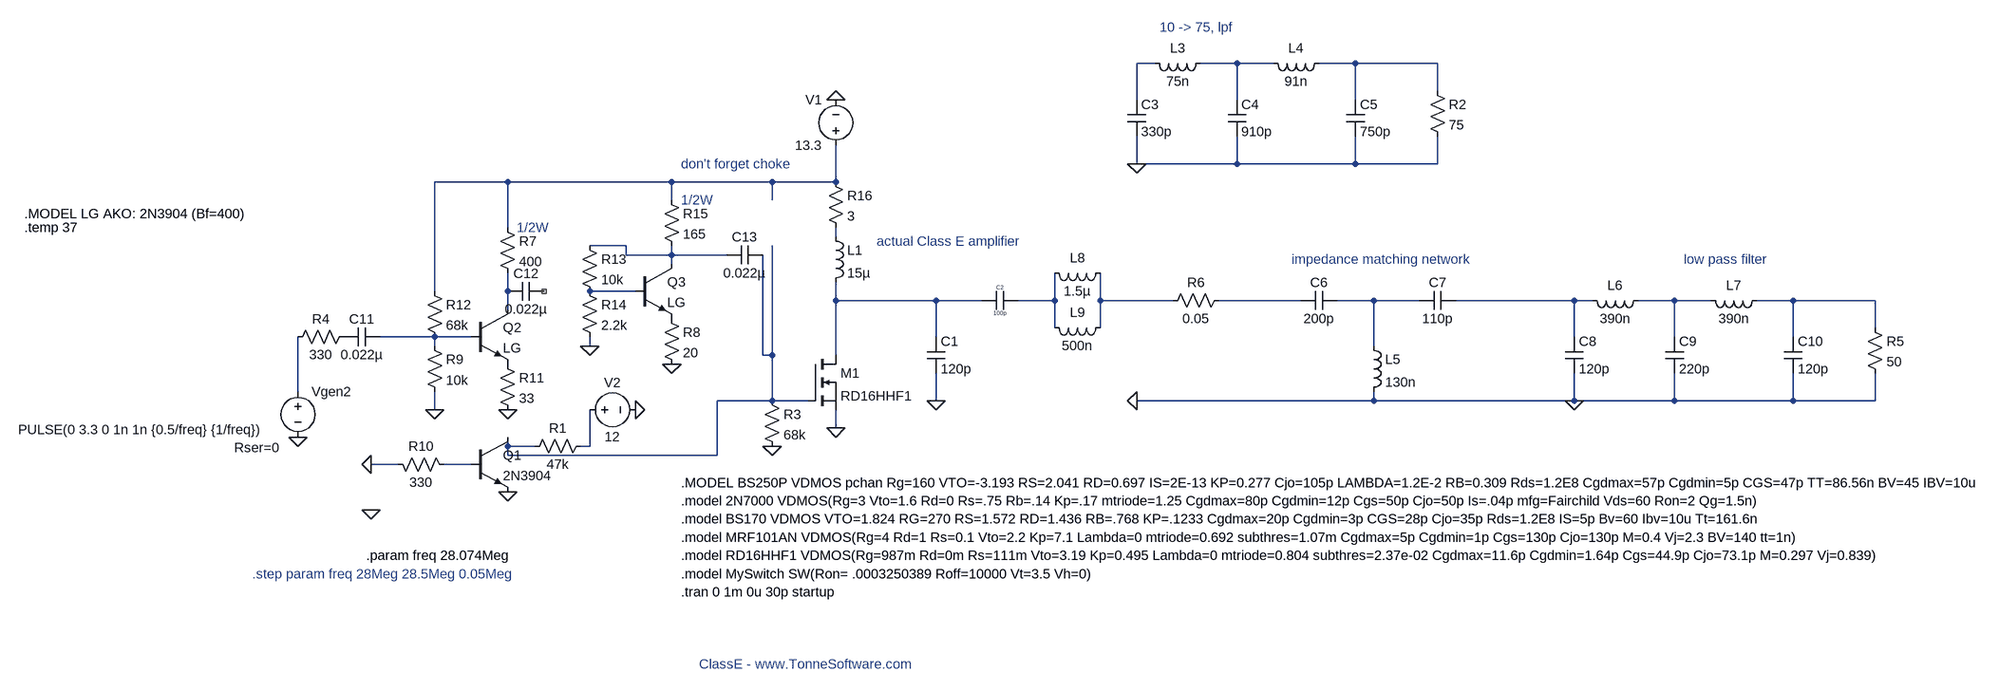
[diagram p0: schematic 28mhz_class_e_latest.asc]
28mhz_class_e_latest.asc, the LTspice schematic file:
Version 4
SHEET 1 2496 912
WIRE 832 -528 800 -528
WIRE 976 -528 912 -528
WIRE 1040 -528 976 -528
WIRE 1184 -528 1120 -528
WIRE 1328 -528 1184 -528
WIRE 1328 -480 1328 -528
WIRE 800 -464 800 -528
WIRE 976 -464 976 -528
WIRE 1184 -464 1184 -528
WIRE 800 -352 800 -400
WIRE 976 -352 976 -400
WIRE 976 -352 800 -352
WIRE 1184 -352 1184 -400
WIRE 1184 -352 976 -352
WIRE 1328 -352 1328 -400
WIRE 1328 -352 1184 -352
WIRE -304 -320 -432 -320
WIRE -16 -320 -304 -320
WIRE 160 -320 -16 -320
WIRE 272 -320 272 -384
WIRE 272 -320 160 -320
WIRE -16 -288 -16 -320
WIRE 160 -288 160 -320
WIRE -304 -240 -304 -320
WIRE 272 -224 272 -240
WIRE -96 -208 -160 -208
WIRE -96 -192 -96 -208
WIRE -16 -192 -16 -208
WIRE -16 -192 -96 -192
WIRE 80 -192 -16 -192
WIRE -16 -176 -16 -192
WIRE -432 -128 -432 -320
WIRE -304 -128 -304 -160
WIRE -80 -128 -160 -128
WIRE 272 -112 272 -144
WIRE 448 -112 272 -112
WIRE 528 -112 448 -112
WIRE 656 -112 656 -160
WIRE 656 -112 592 -112
WIRE 736 -112 736 -160
WIRE 864 -112 736 -112
WIRE 1088 -112 944 -112
WIRE 1216 -112 1152 -112
WIRE 1296 -112 1216 -112
WIRE 1568 -112 1360 -112
WIRE 1600 -112 1568 -112
WIRE 1744 -112 1680 -112
WIRE 1808 -112 1744 -112
WIRE 1952 -112 1888 -112
WIRE 2096 -112 1952 -112
WIRE -304 -96 -304 -128
WIRE 656 -64 656 -112
WIRE 736 -64 736 -112
WIRE 2096 -64 2096 -112
WIRE -432 -48 -528 -48
WIRE -368 -48 -432 -48
WIRE 448 -48 448 -112
WIRE 1568 -48 1568 -112
WIRE 1744 -48 1744 -112
WIRE 1952 -48 1952 -112
WIRE -432 -32 -432 -48
WIRE -160 -32 -160 -48
WIRE 1216 -32 1216 -112
WIRE 144 -16 144 -192
WIRE 160 -16 160 -208
WIRE 160 -16 144 -16
WIRE 272 -16 272 -112
WIRE -672 48 -672 -48
WIRE 160 64 160 -16
WIRE 160 64 64 64
WIRE 224 64 160 64
WIRE 448 64 448 16
WIRE 1216 64 1216 48
WIRE 1216 64 800 64
WIRE 1568 64 1568 16
WIRE 1568 64 1216 64
WIRE 1744 64 1744 16
WIRE 1744 64 1568 64
WIRE 1952 64 1952 16
WIRE 1952 64 1744 64
WIRE 2096 64 2096 16
WIRE 2096 64 1952 64
WIRE -432 80 -432 48
WIRE 272 112 272 80
WIRE -304 144 -304 128
WIRE -256 144 -304 144
WIRE -160 144 -160 80
WIRE -160 144 -176 144
WIRE -304 160 -304 144
WIRE 64 160 64 64
WIRE 64 160 -304 160
WIRE -496 176 -544 176
WIRE -368 176 -416 176
FLAG 272 112 0
FLAG 448 64 0
FLAG 800 64 0
FLAG -672 128 0
FLAG 800 -352 0
FLAG 1568 64 0
FLAG 272 -464 0
FLAG -304 80 0
FLAG -432 80 0
FLAG -160 -32 0
FLAG -16 0 0
FLAG 160 144 0
FLAG -80 80 0
FLAG -304 224 0
FLAG -544 256 0
FLAG -544 176 0
SYMBOL ind 256 -240 R0
SYMATTR InstName L1
SYMATTR Value 15µ
SYMBOL cap 432 -48 R0
SYMATTR InstName C1
SYMATTR Value 120p
SYMBOL cap 592 -128 R90
WINDOW 0 0 32 VBottom 0
WINDOW 3 32 32 VTop 0
SYMATTR InstName C2
SYMATTR Value 100p
SYMBOL nmos 224 -16 R0
SYMATTR InstName M1
SYMATTR Value RD16HHF1
SYMBOL voltage -672 32 R0
WINDOW 123 24 132 Left 0
WINDOW 39 -112 115 Left 2
WINDOW 3 -491 83 Left 2
SYMATTR SpiceLine Rser=0
SYMATTR Value PULSE(0 3.3 0 1n 1n {0.5/freq} {1/freq})
SYMATTR InstName Vgen2
SYMBOL ind 928 -544 R90
WINDOW 0 5 56 VBottom 2
WINDOW 3 32 56 VTop 2
SYMATTR InstName L3
SYMATTR Value 75n
SYMBOL ind 1136 -544 R90
WINDOW 0 5 56 VBottom 2
WINDOW 3 32 56 VTop 2
SYMATTR InstName L4
SYMATTR Value 91n
SYMBOL cap 784 -464 R0
SYMATTR InstName C3
SYMATTR Value 330p
SYMBOL cap 960 -464 R0
SYMATTR InstName C4
SYMATTR Value 910p
SYMBOL cap 1168 -464 R0
SYMATTR InstName C5
SYMATTR Value 750p
SYMBOL res 1312 -496 R0
SYMATTR InstName R2
SYMATTR Value 75
SYMBOL cap 1152 -128 R90
WINDOW 0 0 32 VBottom 2
WINDOW 3 32 32 VTop 2
SYMATTR InstName C6
SYMATTR Value 200p
SYMBOL ind 1200 -48 R0
SYMATTR InstName L5
SYMATTR Value 130n
SYMBOL cap 1360 -128 R90
WINDOW 0 0 32 VBottom 2
WINDOW 3 32 32 VTop 2
SYMATTR InstName C7
SYMATTR Value 110p
SYMBOL ind 1696 -128 R90
WINDOW 0 5 56 VBottom 2
WINDOW 3 32 56 VTop 2
SYMATTR InstName L6
SYMATTR Value 390n
SYMBOL ind 1904 -128 R90
WINDOW 0 5 56 VBottom 2
WINDOW 3 32 56 VTop 2
SYMATTR InstName L7
SYMATTR Value 390n
SYMBOL cap 1552 -48 R0
SYMATTR InstName C8
SYMATTR Value 120p
SYMBOL cap 1728 -48 R0
SYMATTR InstName C9
SYMATTR Value 220p
SYMBOL cap 1936 -48 R0
SYMATTR InstName C10
SYMATTR Value 120p
SYMBOL res 2080 -80 R0
SYMATTR InstName R5
SYMATTR Value 50
SYMBOL ind 752 -176 R90
WINDOW 0 5 56 VBottom 2
WINDOW 3 32 56 VTop 2
SYMATTR InstName L8
SYMATTR Value 1.5µ
SYMBOL ind 752 -80 R90
WINDOW 0 5 56 VBottom 2
WINDOW 3 32 56 VTop 2
SYMATTR InstName L9
SYMATTR Value 500n
SYMBOL res 960 -128 R90
WINDOW 0 0 56 VBottom 2
WINDOW 3 32 56 VTop 2
SYMATTR InstName R6
SYMATTR Value 0.05
SYMBOL voltage 272 -368 R180
WINDOW 0 24 96 Left 2
WINDOW 3 24 16 Left 2
WINDOW 123 0 0 Left 0
WINDOW 39 0 0 Left 0
SYMATTR InstName V1
SYMATTR Value 13.3
SYMBOL res -576 -64 R90
WINDOW 0 0 56 VBottom 2
WINDOW 3 32 56 VTop 2
SYMATTR InstName R4
SYMATTR Value 330
SYMBOL npn -368 -96 R0
SYMATTR InstName Q2
SYMATTR Value LG
SYMBOL res -320 -256 R0
SYMATTR InstName R7
SYMATTR Value 400
SYMATTR SpiceLine pwr=0.5
SYMBOL res -448 -48 R0
SYMATTR InstName R9
SYMATTR Value 10k
SYMBOL res -320 -16 R0
SYMATTR InstName R11
SYMATTR Value 33
SYMBOL res -448 -144 R0
SYMATTR InstName R12
SYMATTR Value 68k
SYMBOL cap -528 -64 R90
WINDOW 0 0 32 VBottom 2
WINDOW 3 32 32 VTop 2
SYMATTR InstName C11
SYMATTR Value 0.022µ
SYMBOL res -176 -224 R0
SYMATTR InstName R13
SYMATTR Value 10k
SYMBOL res -176 -144 R0
SYMATTR InstName R14
SYMATTR Value 2.2k
SYMBOL npn -80 -176 R0
SYMATTR InstName Q3
SYMATTR Value LG
SYMBOL res -32 -304 R0
SYMATTR InstName R15
SYMATTR Value 165
SYMATTR SpiceLine pwr=0.5
SYMBOL res -32 -96 R0
SYMATTR InstName R8
SYMATTR Value 20
SYMBOL cap 144 -208 R90
WINDOW 0 0 32 VBottom 2
WINDOW 3 32 32 VTop 2
SYMATTR InstName C13
SYMATTR Value 0.022µ
SYMBOL res -160 128 R90
WINDOW 0 0 56 VBottom 2
WINDOW 3 32 56 VTop 2
SYMATTR InstName R1
SYMATTR Value 47k
SYMBOL res 144 48 R0
SYMATTR InstName R3
SYMATTR Value 68k
SYMBOL cap -240 -144 R90
WINDOW 0 0 32 VBottom 2
WINDOW 3 32 32 VTop 2
SYMATTR InstName C12
SYMATTR Value 0.022µ
SYMBOL npn -368 128 R0
SYMATTR InstName Q1
SYMATTR Value 2N3904
SYMBOL voltage -176 80 R270
WINDOW 0 32 56 VTop 2
WINDOW 3 -32 56 VBottom 2
WINDOW 123 0 0 Left 0
WINDOW 39 0 0 Left 0
SYMATTR InstName V2
SYMATTR Value 12
SYMBOL res -512 160 M90
WINDOW 0 0 56 VBottom 2
WINDOW 3 32 56 VTop 2
SYMATTR InstName R10
SYMATTR Value 330
SYMBOL res 256 -336 R0
SYMATTR InstName R16
SYMATTR Value 3
TEXT 0 368 Left 2 !.model MySwitch SW(Ron= .0003250389 Roff=10000 Vt=3.5 Vh=0)
TEXT 0 400 Left 2 !.tran 0 1m 0u 30p startup
TEXT 32 528 Left 2 ;ClassE - www.TonneSoftware.com
TEXT 0 336 Left 2 !.model RD16HHF1 VDMOS(Rg=987m Rd=0m Rs=111m Vto=3.19 Kp=0.495 Lambda=0 mtriode=0.804 subthres=2.37e-02 Cgdmax=11.6p Cgdmin=1.64p Cgs=44.9p Cjo=73.1p M=0.297 Vj=0.839)
TEXT 344 -216 Left 2 ;actual Class E amplifier
TEXT -552 336 Left 2 !.param freq 28.074Meg
TEXT -752 368 Left 2 ;.step param freq 28Meg 28.5Meg 0.05Meg
TEXT 840 -592 Left 2 ;10 -> 75, lpf
TEXT 1072 -184 Left 2 ;impedance matching network
TEXT 1760 -184 Left 2 ;low pass filter
TEXT 0 304 Left 2 !.model MRF101AN VDMOS(Rg=4 Rd=1 Rs=0.1 Vto=2.2 Kp=7.1 Lambda=0 mtriode=0.692 subthres=1.07m Cgdmax=5p Cgdmin=1p Cgs=130p Cjo=130p M=0.4 Vj=2.3 BV=140 tt=1n)
TEXT 0 272 Left 2 !.model BS170 VDMOS VTO=1.824 RG=270 RS=1.572 RD=1.436 RB=.768 KP=.1233 Cgdmax=20p Cgdmin=3p CGS=28p Cjo=35p Rds=1.2E8 IS=5p Bv=60 Ibv=10u Tt=161.6n
TEXT 0 240 Left 2 !.model 2N7000 VDMOS(Rg=3 Vto=1.6 Rd=0 Rs=.75 Rb=.14 Kp=.17 mtriode=1.25 Cgdmax=80p Cgdmin=12p Cgs=50p Cjo=50p Is=.04p mfg=Fairchild Vds=60 Ron=2 Qg=1.5n)
TEXT 0 208 Left 2 !.MODEL BS250P VDMOS pchan Rg=160 VTO=-3.193 RS=2.041 RD=0.697 IS=2E-13 KP=0.277 Cjo=105p LAMBDA=1.2E-2 RB=0.309 Rds=1.2E8 Cgdmax=57p Cgdmin=5p CGS=47p TT=86.56n BV=45 IBV=10u
TEXT -288 -240 Left 2 ;1/2W
TEXT 0 -288 Left 2 ;1/2W
TEXT 0 -352 Left 2 ;don't forget choke
TEXT -1152 -264 Left 2 !.MODEL LG AKO: 2N3904 (Bf=400)
TEXT -1152 -240 Left 2 !.temp 37

The netlist it stands for:
* 28mhz_class_e_latest.asc
L1 N005 N009 15µ
C1 N009 0 120p
C2 N010 N009 100p
M1 N009 N018 0 0 RD16HHF1
Vgen2 N019 0 PULSE(0 3.3 0 1n 1n {0.5/freq} {1/freq}) Rser=0
L3 N002 N001 75n
L4 N003 N002 91n
C3 N001 0 330p
C4 N002 0 910p
C5 N003 0 750p
R2 N003 0 75
C6 N013 N012 200p
L5 N013 0 130n
C7 N014 N013 110p
L6 N015 N014 390n
L7 N016 N015 390n
C8 N014 0 120p
C9 N015 0 220p
C10 N016 0 120p
R5 N016 0 50
L8 N011 N010 1.5µ
L9 N011 N010 500n
R6 N012 N011 0.05
V1 N004 0 13.3
R4 P001 N019 330
Q2 N007 N017 P002 0 LG
R7 N004 N007 400 pwr=0.5
R9 N017 0 10k
R11 P002 0 33
R12 N004 N017 68k
C11 N017 P001 0.022µ
R13 N006 N008 10k
R14 N008 0 2.2k
Q3 N006 N008 P003 0 LG
R15 N004 N006 165 pwr=0.5
R8 P003 0 20
C13 N018 N006 0.022µ
R1 N020 N018 47k
R3 N018 0 68k
C12 NC_01 N007 0.022µ
Q1 N018 N021 0 0 2N3904
V2 N020 0 12
R10 0 N021 330
R16 N004 N005 3
.model NPN NPN
.model PNP PNP
.lib standard.bjt
.model NMOS NMOS
.model PMOS PMOS
.lib standard.mos
.model MySwitch SW(Ron= .0003250389 Roff=10000 Vt=3.5 Vh=0)
.tran 0 1m 0u 30p startup
* ClassE - www.TonneSoftware.com
.model RD16HHF1 VDMOS(Rg=987m Rd=0m Rs=111m Vto=3.19 Kp=0.495 Lambda=0 mtriode=0.804 subthres=2.37e-02 Cgdmax=11.6p Cgdmin=1.64p Cgs=44.9p Cjo=73.1p M=0.297 Vj=0.839)
* actual Class E amplifier
.param freq 28.074Meg
* .step param freq 28Meg 28.5Meg 0.05Meg
* 10 -> 75, lpf
* impedance matching network
* low pass filter
.model MRF101AN VDMOS(Rg=4 Rd=1 Rs=0.1 Vto=2.2 Kp=7.1 Lambda=0 mtriode=0.692 subthres=1.07m Cgdmax=5p Cgdmin=1p Cgs=130p Cjo=130p M=0.4 Vj=2.3 BV=140 tt=1n)
.model BS170 VDMOS VTO=1.824 RG=270 RS=1.572 RD=1.436 RB=.768 KP=.1233 Cgdmax=20p Cgdmin=3p CGS=28p Cjo=35p Rds=1.2E8 IS=5p Bv=60 Ibv=10u Tt=161.6n
.model 2N7000 VDMOS(Rg=3 Vto=1.6 Rd=0 Rs=.75 Rb=.14 Kp=.17 mtriode=1.25 Cgdmax=80p Cgdmin=12p Cgs=50p Cjo=50p Is=.04p mfg=Fairchild Vds=60 Ron=2 Qg=1.5n)
.MODEL BS250P VDMOS pchan Rg=160 VTO=-3.193 RS=2.041 RD=0.697 IS=2E-13 KP=0.277 Cjo=105p LAMBDA=1.2E-2 RB=0.309 Rds=1.2E8 Cgdmax=57p Cgdmin=5p CGS=47p TT=86.56n BV=45 IBV=10u
* 1/2W
* 1/2W
* don't forget choke
.MODEL LG AKO: 2N3904 (Bf=400)
.temp 37
.backanno
.end